# EasyEDA schematic INJ_HeatExchanger-02.json
TITLE: Sheet_1; REV: 1.0; Date: 2025-04-23; Sheet: 1/1; Company: Your Company
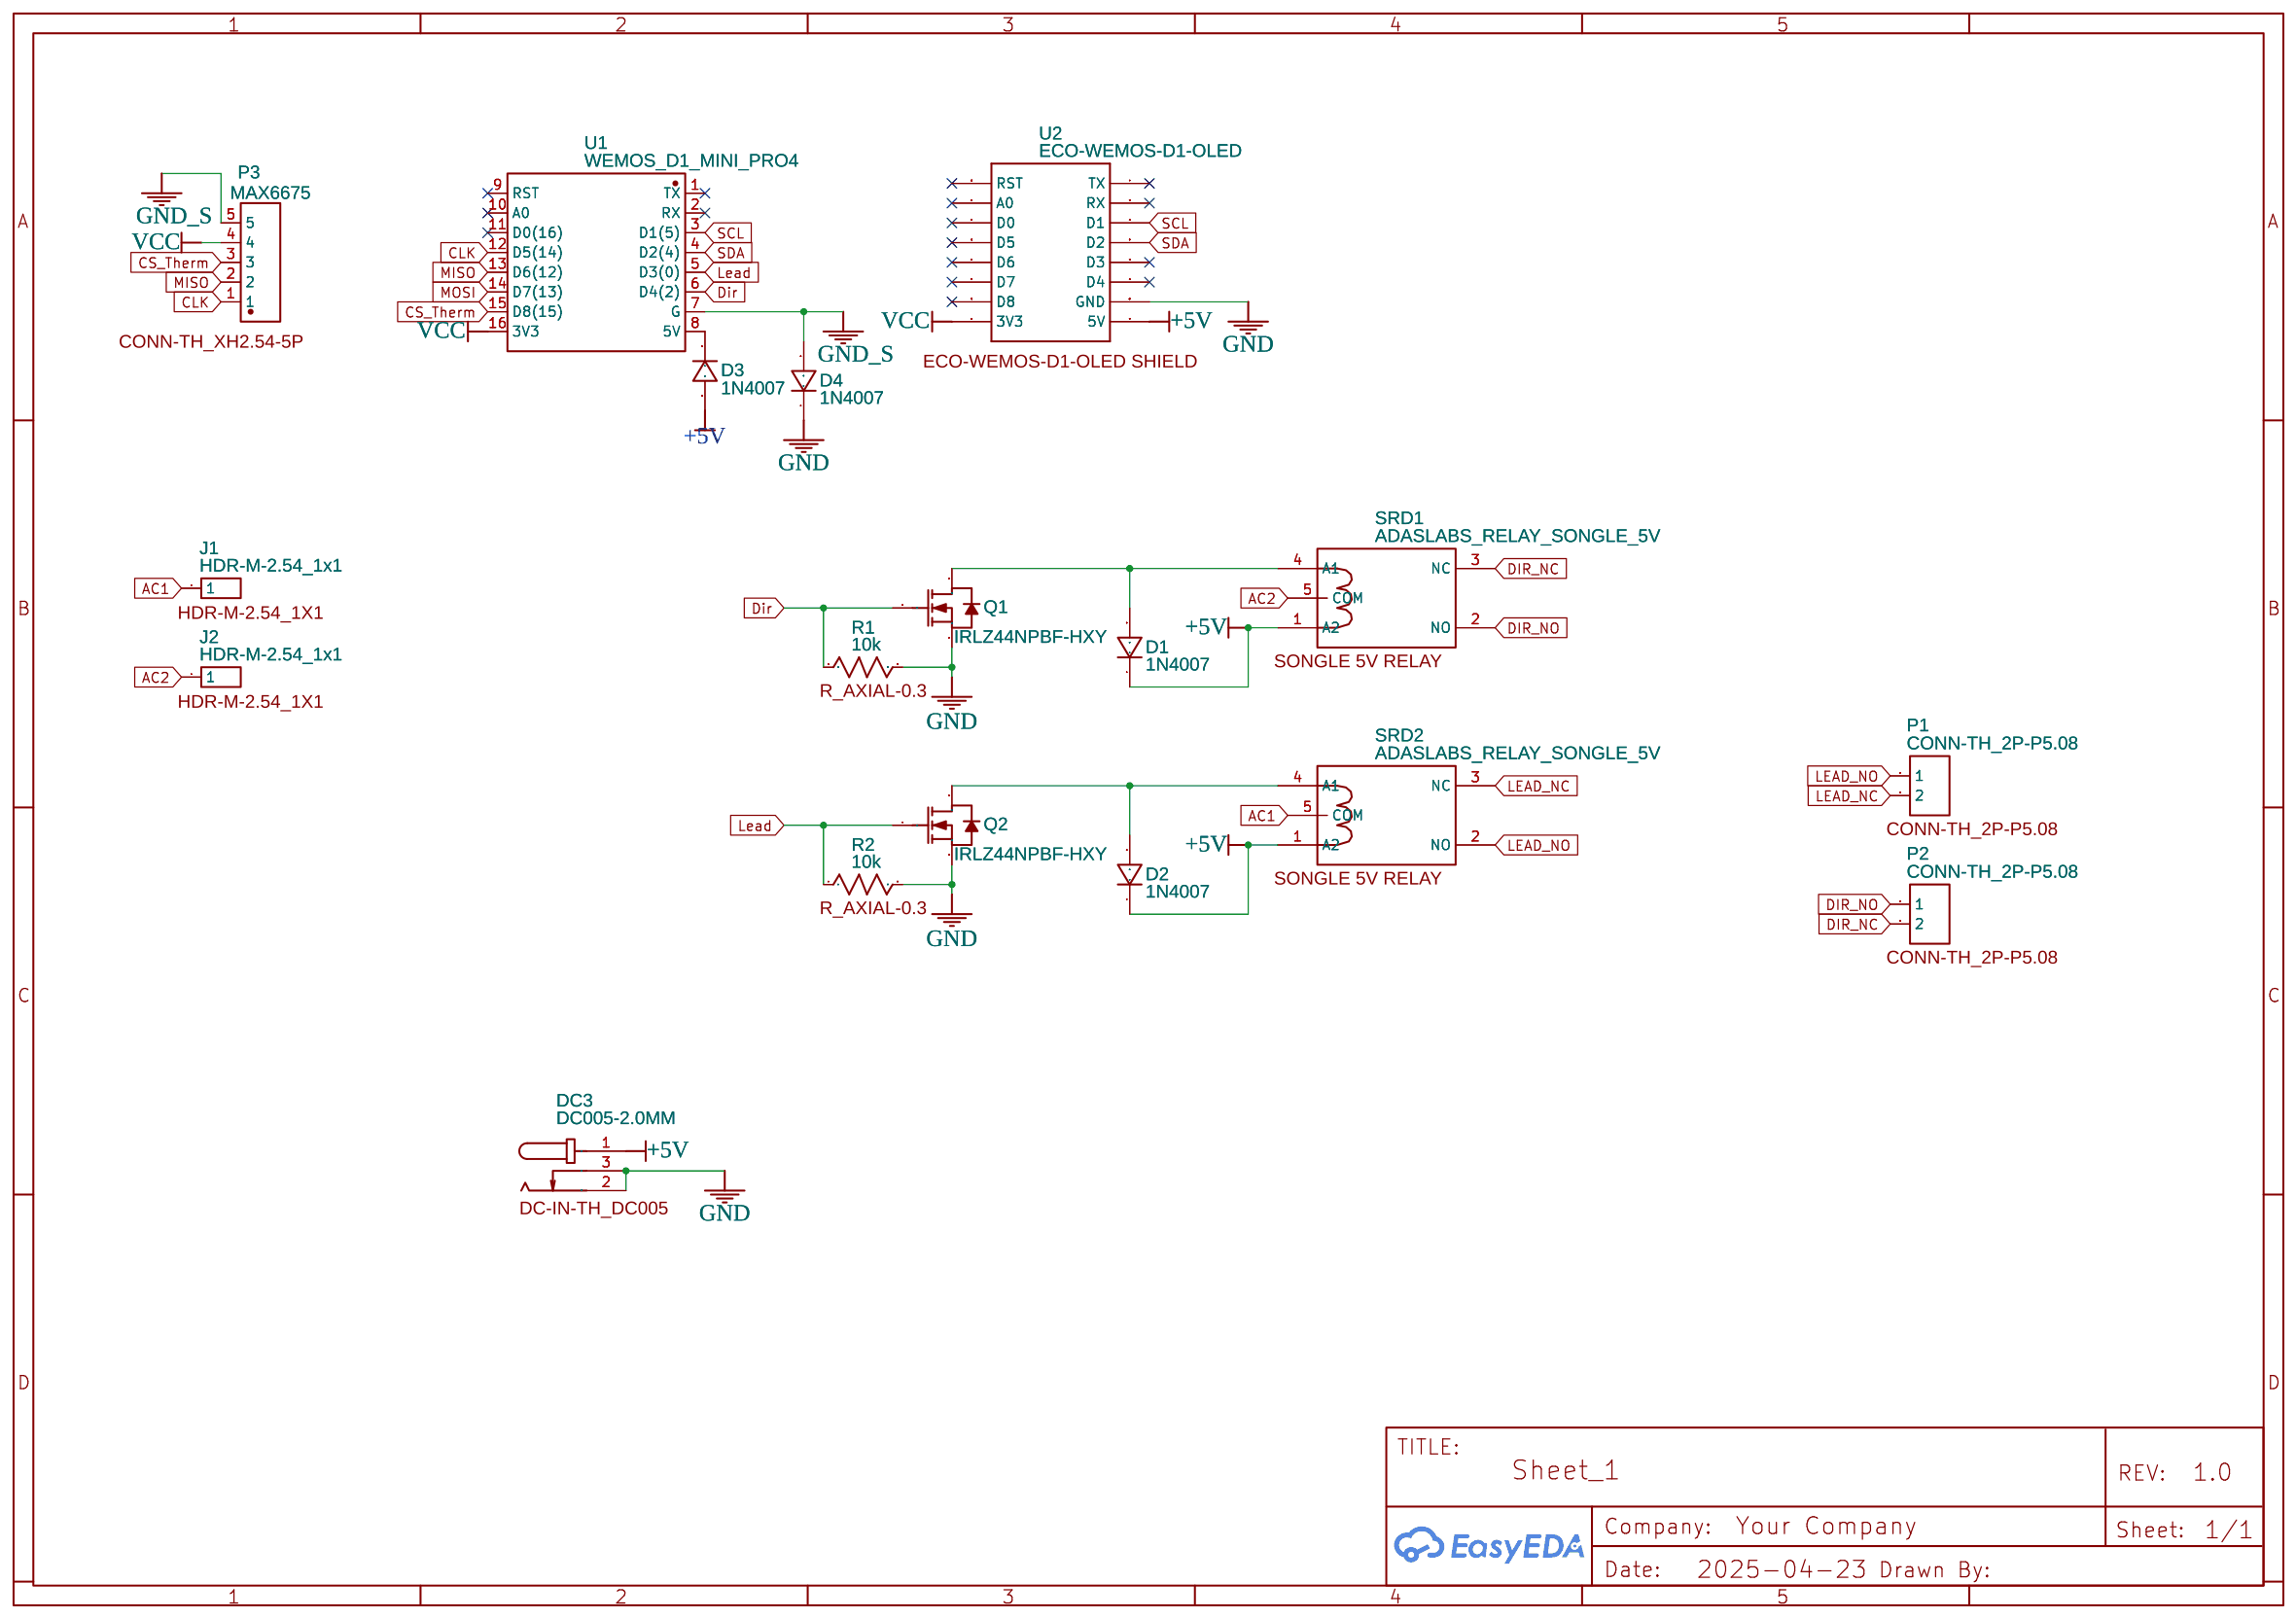
[diagram p0: schematic sheet]

## Parts
D1  1N4007  [DO-41_BD2.4-L4.7-P8.70-D0.9-RD]
D2  1N4007  [DO-41_BD2.4-L4.7-P8.70-D0.9-RD]
D3  1N4007  [DO-41_BD2.4-L4.7-P8.70-D0.9-RD]
D4  1N4007  [DO-41_BD2.4-L4.7-P8.70-D0.9-RD]
DC3  DC005-2.0MM  [DC-IN-TH_DC005]
J1  HDR-M-2.54_1x1  [HDR-M-2.54_1X1]
J2  HDR-M-2.54_1x1  [HDR-M-2.54_1X1]
P1  CONN-TH_2P-P5.08  [CONN-TH_2P-P5.08]
P2  CONN-TH_2P-P5.08  [CONN-TH_2P-P5.08]
P3  MAX6675  [CONN-TH_XH2.54-5P]
Q1  IRLZ44NPBF-HXY  [TO-220-3_L9.9-W4.5-P2.54-L-1]
Q2  IRLZ44NPBF-HXY  [TO-220-3_L9.9-W4.5-P2.54-L-1]
R1  10k  [R_AXIAL-0.3]
R2  10k  [R_AXIAL-0.3]
SRD1  ADASLABS_RELAY_SONGLE_5V  [SONGLE 5V RELAY]
SRD2  ADASLABS_RELAY_SONGLE_5V  [SONGLE 5V RELAY]
U1  WEMOS_D1_MINI_PRO4  [DIP-16_WEMOS_D1_MINI_PRO4]
U2  ECO-WEMOS-D1-OLED  [ECO-WEMOS-D1-OLED SHIELD]

## Library data of the parts
D1-D4 = 1N4007: Supplier: LCSC; Manufacturer: SEMTECH; Supplier Part: C106903; Contributor: LCEDA_Lib; Package Display: No
DC3 = DC005-2.0MM: Supplier: LCSC; Manufacturer: SOFNG; Supplier Part: C111567; Package Display: Yes
J1 J2 = HDR-M-2.54_1x1: Supplier Part: C81276; Supplier: LCSC; Contributor: LCEDA_Lib; Package Display: Yes
P1 P2 = CONN-TH_2P-P5.08: Supplier: LCSC; Contributor: LCEDA_Lib; Package Display: Yes
P3 = XH-2.54-5P: Contributor: LCSC; Supplier: LCSC; Supplier Part: C9900003918; Manufacturer: null; Package Display: Yes
Q1 Q2 = IRLZ44NPBF-HXY: Supplier: LCSC; Supplier Part: C22367197; Manufacturer: HXY MOSFET(华轩阳电子); JLCPCB Part Class: Extended Part; Contributor: lcsc; Package Display: No
R1 R2 = R_AXIAL-0.3_US: Contributor: LCEDA_Lib; Package Display: Yes
SRD1 SRD2 = ADASLABS_RELAY_SONGLE_5V: Supplier Part: undefined; Contributor: Hida Suryo; Package Display: Yes
U1 = WEMOS_D1_MINI_PRO4: Contributor: LCSC; Supplier: LCSC; Supplier Part: C2837266; Manufacturer: null; Manufacturer Part: Wemos_D1_mini_Pro4; JLCPCB Part Class: Extended Part; Package Display: No
U2 = ECO-WEMOS-D1-OLED: sourceId: YemgaslDx; Contributor: ecoenghk; Package Display: Yes

## Nets
+5V: D1.1 D2.1 D3.2 DC3.1 SRD1.1(A2) SRD2.1(A2) U2.5V
GND: D4.1 DC3.2 DC3.3 Q1.3(S) Q2.3(S) R1.2 R2.2 U2.GND
GND_S: D4.2 P3.5 U1.7(G)
VCC: P3.4 U1.16(3V3) U2.3V3
AC1: J1.1 SRD2.5(COM)
AC2: J2.1 SRD1.5(COM)
CLK: P3.1 U1.12(D5(14))
CS_Therm: P3.3 U1.15(D8(15))
Dir: Q1.1(G) R1.1 U1.6(D4(2))
DIR_NC: P2.2 SRD1.3(NC)
DIR_NO: P2.1 SRD1.2(NO)
Lead: Q2.1(G) R2.1 U1.5(D3(0))
LEAD_NC: P1.2 SRD2.3(NC)
LEAD_NO: P1.1 SRD2.2(NO)
MISO: P3.2 U1.13(D6(12))
MOSI: U1.14(D7(13))
SCL: U1.3(D1(5)) U2.D1
SDA: U1.4(D2(4)) U2.D2
Net-(D1-2): D1.2 Q1.2(D) SRD1.4(A1)
Net-(D2-2): D2.2 Q2.2(D) SRD2.4(A1)
Net-(D3-1): D3.1 U1.8(5V)

Not connected (* = marked no-connect by the designer): U1 1(TX)* 2(RX)* 9(RST)* 10(A0)* 11(D0(16))*; U2 A0* D0* D3* D4* D5* D6* D7* D8* RST* RX* TX*
